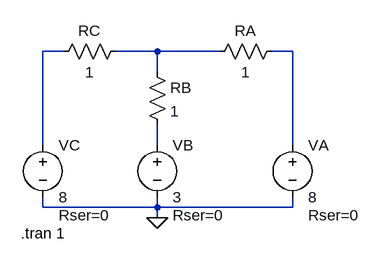
[diagram p0: schematic BLDC_circuit.asc]
BLDC_circuit.asc, the LTspice schematic file:
Version 4
SHEET 1 880 680
WIRE 48 16 16 16
WIRE 192 16 128 16
WIRE 288 16 192 16
WIRE 400 16 368 16
WIRE 192 48 192 16
WIRE 16 160 16 16
WIRE 192 160 192 128
WIRE 400 160 400 16
WIRE 16 256 16 240
WIRE 192 256 192 240
WIRE 192 256 16 256
WIRE 400 256 400 240
WIRE 400 256 192 256
WIRE 192 272 192 256
FLAG 192 272 0
SYMBOL res 176 32 R0
SYMATTR InstName RB
SYMATTR Value 1
SYMBOL res 144 0 R90
WINDOW 0 0 56 VBottom 2
WINDOW 3 32 56 VTop 2
SYMATTR InstName RC
SYMATTR Value 1
SYMBOL res 384 0 R90
WINDOW 0 0 56 VBottom 2
WINDOW 3 32 56 VTop 2
SYMATTR InstName RA
SYMATTR Value 1
SYMBOL voltage 16 144 R0
WINDOW 123 0 0 Left 0
WINDOW 39 24 124 Left 2
SYMATTR InstName VC
SYMATTR Value 8
SYMATTR SpiceLine Rser=0
SYMBOL voltage 192 144 R0
WINDOW 123 0 0 Left 0
WINDOW 39 24 124 Left 2
SYMATTR InstName VB
SYMATTR Value 3
SYMATTR SpiceLine Rser=0
SYMBOL voltage 400 144 R0
WINDOW 123 0 0 Left 0
WINDOW 39 24 124 Left 2
SYMATTR InstName VA
SYMATTR Value 8
SYMATTR SpiceLine Rser=0
TEXT -18 296 Left 2 !.tran 1

The netlist it stands for:
* BLDC_circuit.asc
RB N002 N004 1
RC N002 N001 1
RA N003 N002 1
VC N001 0 8 Rser=0
VB N004 0 3 Rser=0
VA N003 0 8 Rser=0
.tran 1
.backanno
.end